# Altium schematic sheet power-v1v35.SchDoc: CS - Power 1.35V
size Letter; CheckedBy: J. Brinton; CompanyName: Signal Laboratories, Inc.; DrawnBy: J. Brinton; Engineer: J. Brinton; Address1: 3479 Edison Way; Address2: Menlo Park CA 94025; Address3: +1 (877) 778-8435; Address4: siglabs.com; Revision: 3; SheetNumber: 44; SheetTotal: 47
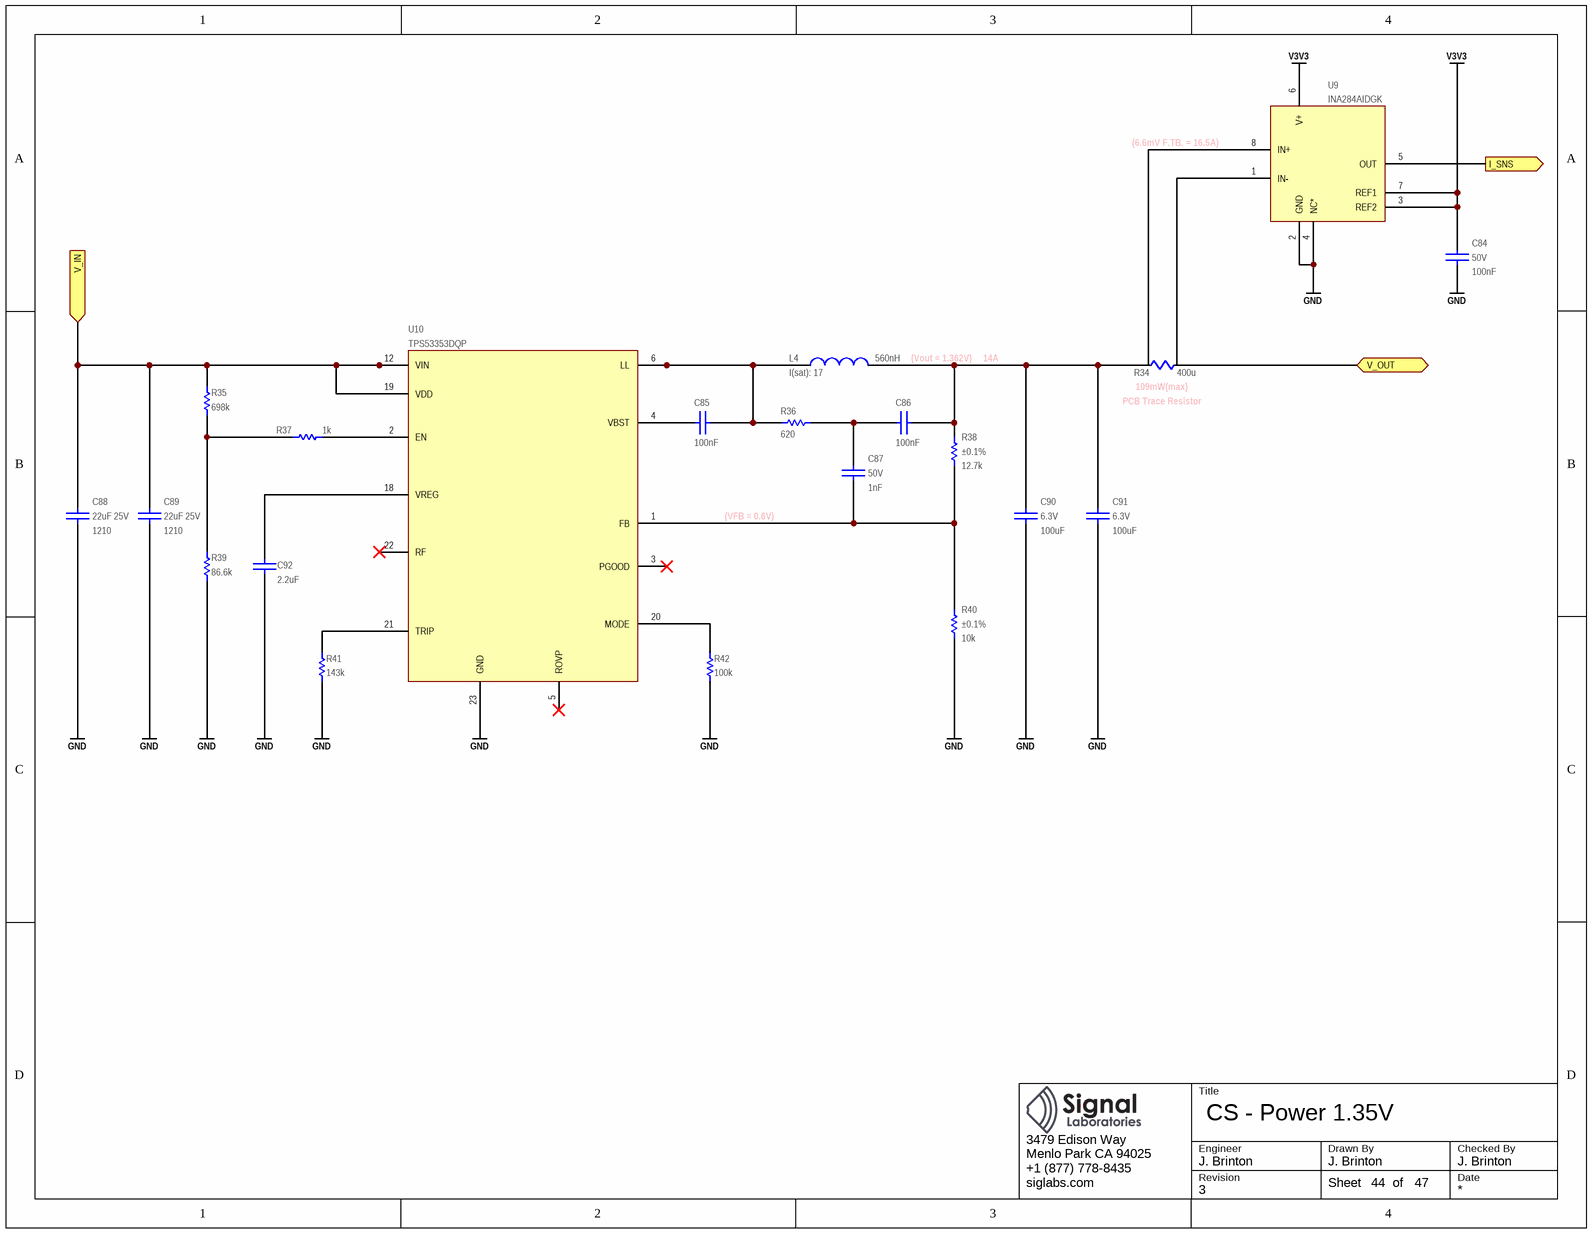
[diagram p0: power-v1v35.SchDoc]

## Parts
C84  value 100nF  Voltage: 50V  [CAPC100X50X55L25N]  (hidden comment: GCM155R71H104KE02)
C85  value 100nF  [CAPC100X50X55L25N]  (hidden comment: GCM155R71H104KE02)
C86  value 100nF  [CAPC100X50X55L25N]  (hidden comment: GCM155R71H104KE02)
C87  value 1nF  Voltage: 50V  [CAPC100X50X55L25N]  (hidden comment: GRM155R71H102KA01)
C88  value 22uF  Voltage: 25V  Package: 1210  [CAPC320X250X270L50N]  (hidden comment: GRM32ER71E226KE15)
C89  value 22uF  Voltage: 25V  Package: 1210  [CAPC320X250X270L50N]  (hidden comment: GRM32ER71E226KE15)
C90  value 100uF  Voltage: 6.3V  [CAPC320X250X280L50N]  (hidden comment: C3225X6S0J107M250)
C91  value 100uF  Voltage: 6.3V  [CAPC320X250X280L50N]  (hidden comment: C3225X6S0J107M250)
C92  value 2.2uF  [CAPC160X80X90L20N]  (hidden comment: C1608X7R1A225M080)
L4  value 560nH  I(sat): 17  [XAL6030]  (hidden comment: XAL6030-561ME)
R34  value 400u  [RES0.0004]  (hidden comment: RES0.0004)  (net tie, no BOM)
R35  value 698k  [RESC1005X40N]  (hidden comment: ERJ-2RKF6983X)
R36  value 620  [RESC1005X40N]  (hidden comment: ERJ-2RKF6200X)
R37  value 1k  [RESC1005X40N]  (hidden comment: ERJ-2RKF1001X)
R38  value 12.7k  Tolerance: ±0.1%  [RESC2012X70N]  (hidden comment: ERA-6AEB1272V)
R39  value 86.6k  [RESC1005X40N]  (hidden comment: ERJ-2RKF8662X)
R40  value 10k  Tolerance: ±0.1%  [RESC2012X70N]  (hidden comment: ERA-6AEB103V)
R41  value 143k  [RESC1005X40N]  (hidden comment: ERJ-2RKF1433X)
R42  value 100k  [RESC1005X40N]  (hidden comment: ERJ-2RKF1003X)
U9  INA284AIDGK  [S-PDSO-G8]
U10  TPS53353DQP  [DQP]

## Ports
I_SNS (out), V_IN (in), V_OUT

## Nets
GND: C84.1 C88.1 C89.1 C90.2 C91.2 C92.1 R39.2 R40.1 R41.2 R42.2 U9.2(GND) U9.4(NC*) U10.23(GND)
V3V3: C84.2 U9.3(REF2) U9.6(V+) U9.7(REF1)
I_SNS: U9.5(OUT) ; port I_SNS
V_IN: C88.2 C89.2 R35.1 U10.12(VIN) U10.13(VIN) U10.14(VIN) U10.15(VIN) U10.16(VIN) U10.17(VIN) U10.19(VDD) ; port V_IN
V_OUT: R34.2 ; port V_OUT
NetC85_1: C85.1 L4.1 R36.2 U10.6(LL) U10.7(LL) U10.8(LL) U10.9(LL) U10.10(LL) U10.11(LL)
NetC85_2: C85.2 U10.4(VBST)
NetC86_1: C86.1 C90.1 C91.1 L4.2 R34.1 R38.2
NetC86_2: C86.2 C87.1 R36.1
NetC87_2: C87.2 R38.1 R40.2 U10.1(FB)
NetC92_2: C92.2 U10.18(VREG)
NetR34_3: R34.3 U9.8(IN+)
NetR34_4: R34.4 U9.1(IN-)
NetR35_2: R35.2 R37.1 R39.1
NetR37_2: R37.2 U10.2(EN)
NetR41_1: R41.1 U10.21(TRIP)
NetR42_1: R42.1 U10.20(MODE)

Not connected (* = marked no-connect by the designer): U10 3(PGOOD)* 5(ROVP)* 22(RF)*

## Notes on the sheet
- (near U9) (6.6mV F.TB. = 16.5A)
- (Vout = 1.362V)
- 14A
- (near R34) 109mW(max)
- (near R34) PCB Trace Resistor
- (VFB = 0.6V)
- Title
- Engineer
- Revision
- Drawn By
- Checked By
- Date
- Sheet
- of

## Library data of the parts
C84-C86 = CAP: Ceramic Capacitor 100nF ±10% 50V X7R 0402; Manufacturer: Murata; Tr: -55:125; Manufacturer P/N: GCM155R71H104KE02; Tolerance: ±10%; Package: 0402
  C85 C86: Voltage: 50V; Footprint: *
C87 = CAP: Ceramic Capacitor 1nF ±10% 50V X7R 0402; Manufacturer: Murata; Tr: -55:125; Manufacturer P/N: GRM155R71H102KA01; Tolerance: ±10%; Package: 0402
C88 C89 = CAP: Ceramic Capacitor 22uF ±10% 25V X7R 1210; Manufacturer: Murata; Tr: -55:125; Manufacturer P/N: GRM32ER71E226KE15; Tolerance: ±10%
C90 C91 = CAP: Ceramic Capacitor 100uF ±20% 6.3V X6S 1210; Manufacturer: TDK; Tr: -55:105; Manufacturer P/N: C3225X6S0J107M250; Tolerance: ±20%; Package: 1210
C92 = CAP: Ceramic Capacitor 2.2uF ±20% 10V X7R 0603; Manufacturer: TDK; Tr: -55:125; Manufacturer P/N: C1608X7R1A225M080; Tolerance: ±20%; Voltage: 10V; Footprint: *; Package: 0603
L4 = INDUCTOR: Shielded Power Inductor 560nH, 17A; Manufacturer: Coilcraft; Manufacturer P/N: XAL6030-561ME
R34 = RES0.0004: Current Sense Resistor 400uOhm TRACE; Manufacturer: *; Manufacturer P/N: *
R35 = RES: Thick Film Resistor 698k ±1% 0.1W 50V 0402; Manufacturer: Panasonic; Tcr: ±100; Tr: -55:155; Voltage: 50; Power: 0.1; Manufacturer P/N: ERJ-2RKF6983X; Tolerance: ±1%; Alternatives: *; Footprint: *; Package: 0402
R36 = RES: Thick Film Resistor 620 ±1% 0.1W 50V 0402; Manufacturer: Panasonic; Tcr: ±100; Tr: -55:155; Voltage: 50; Power: 0.1; Manufacturer P/N: ERJ-2RKF6200X; Tolerance: ±1%; Alternatives: *; Footprint: *; Package: 0402
R37 = RES: Thick Film Resistor 1k ±1% 0.1W 50V 0402; Manufacturer: Panasonic; Tcr: ±100; Tr: -55:155; Voltage: 50; Power: 0.1; Manufacturer P/N: ERJ-2RKF1001X; Tolerance: ±1%; Alternatives: *; Footprint: *; Package: 0402
R38 = RES: Thin Film Resistor 12.7k ±0.1% 0.125W 100V 0805; Manufacturer: Panasonic; Tcr: ±25; Tr: -55:155; Voltage: 100; Power: 0.125; Manufacturer P/N: ERA-6AEB1272V; Package: 0805
R39 = RES: Thick Film Resistor 86.6k ±1% 0.1W 50V 0402; Manufacturer: Panasonic; Tcr: ±100; Tr: -55:155; Voltage: 50; Power: 0.1; Manufacturer P/N: ERJ-2RKF8662X; Tolerance: ±1%; Alternatives: *; Footprint: *; Package: 0402
R40 = RES: Thin Film Resistor 10k ±0.1% 0.125W 100V 0805; Manufacturer: Panasonic; Tcr: ±25; Tr: -55:155; Voltage: 100; Power: 0.125; Manufacturer P/N: ERA-6AEB103V; Package: 0805
R41 = RES: Thick Film Resistor 143k ±1% 0.1W 50V 0402; Manufacturer: Panasonic; Tcr: ±100; Tr: -55:155; Voltage: 50; Power: 0.1; Manufacturer P/N: ERJ-2RKF1433X; Tolerance: ±1%; Alternatives: *; Footprint: *; Package: 0402
R42 = RES: Thick Film Resistor 100k ±1% 0.1W 50V 0402; Manufacturer: Panasonic; Tcr: ±100; Tr: -55:155; Voltage: 50; Power: 0.1; Manufacturer P/N: ERJ-2RKF1003X; Tolerance: ±1%; Alternatives: *; Footprint: *; Package: 0402
U9 = INA283AIDGK: Bidirectional Current Shunt Monitor; Manufacturer: Texas Instruments; Manufacturer P/N: INA284AIDGK
U10 = TPS53319DQPR: Synchronous Buck Converter 20A; Manufacturer: Texas Instruments; Manufacturer P/N: TPS53353DQP